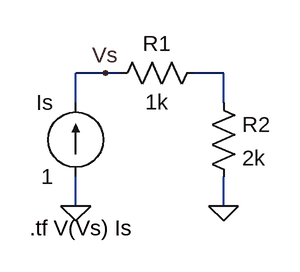
[diagram p0: schematic 04_transferFunction.asc]
04_transferFunction.asc, the LTspice schematic file:
Version 4
SHEET 1 880 680
WIRE 160 112 128 112
WIRE 176 112 160 112
WIRE 288 112 256 112
WIRE 128 144 128 112
WIRE 288 144 288 112
WIRE 128 256 128 224
WIRE 288 256 288 224
FLAG 128 256 0
FLAG 288 256 0
FLAG 160 112 Vs
SYMBOL current 128 224 R180
WINDOW 0 24 80 Left 2
WINDOW 3 24 0 Left 2
SYMATTR InstName Is
SYMATTR Value 1
SYMBOL res 272 96 R90
WINDOW 0 0 56 VBottom 2
WINDOW 3 32 56 VTop 2
SYMATTR InstName R1
SYMATTR Value 1k
SYMBOL res 272 128 R0
SYMATTR InstName R2
SYMATTR Value 2k
TEXT 78 280 Left 2 !.tf V(Vs) Is

The netlist it stands for:
* 04_transferFunction.asc
Is 0 Vs 1
R1 N001 Vs 1k
R2 N001 0 2k
.tf V(Vs) Is
.backanno
.end